# Altium schematic sheet 0084 - MCU.SchDoc: 0084 - AR Display Board
size Tabloid; Date: 3/18/2018; DrawnBy: Ryan Young; DocumentNumber: 1; Revision: 2.1; SheetNumber: 2; SheetTotal: 3; SheetTitle: MCU; PageSetup: Record=PageOptions|CenterHorizontal=True|CenterVertical=True|PrintScale=0.95|XCorrection=1.00|YCorrection=1.00|PrintKind=0|BorderSize=5000000|LeftOffset=0|BottomOffset=0|Orientation=2|PaperLength=1000|PaperWidth=1000|Scale=100|PaperSource=15|PrintQuality=600|MediaType=1|DitherType=10|PaperKind=Letter (8.5 x 11")|PrintScaleMode=1; Time: 3/18/2018
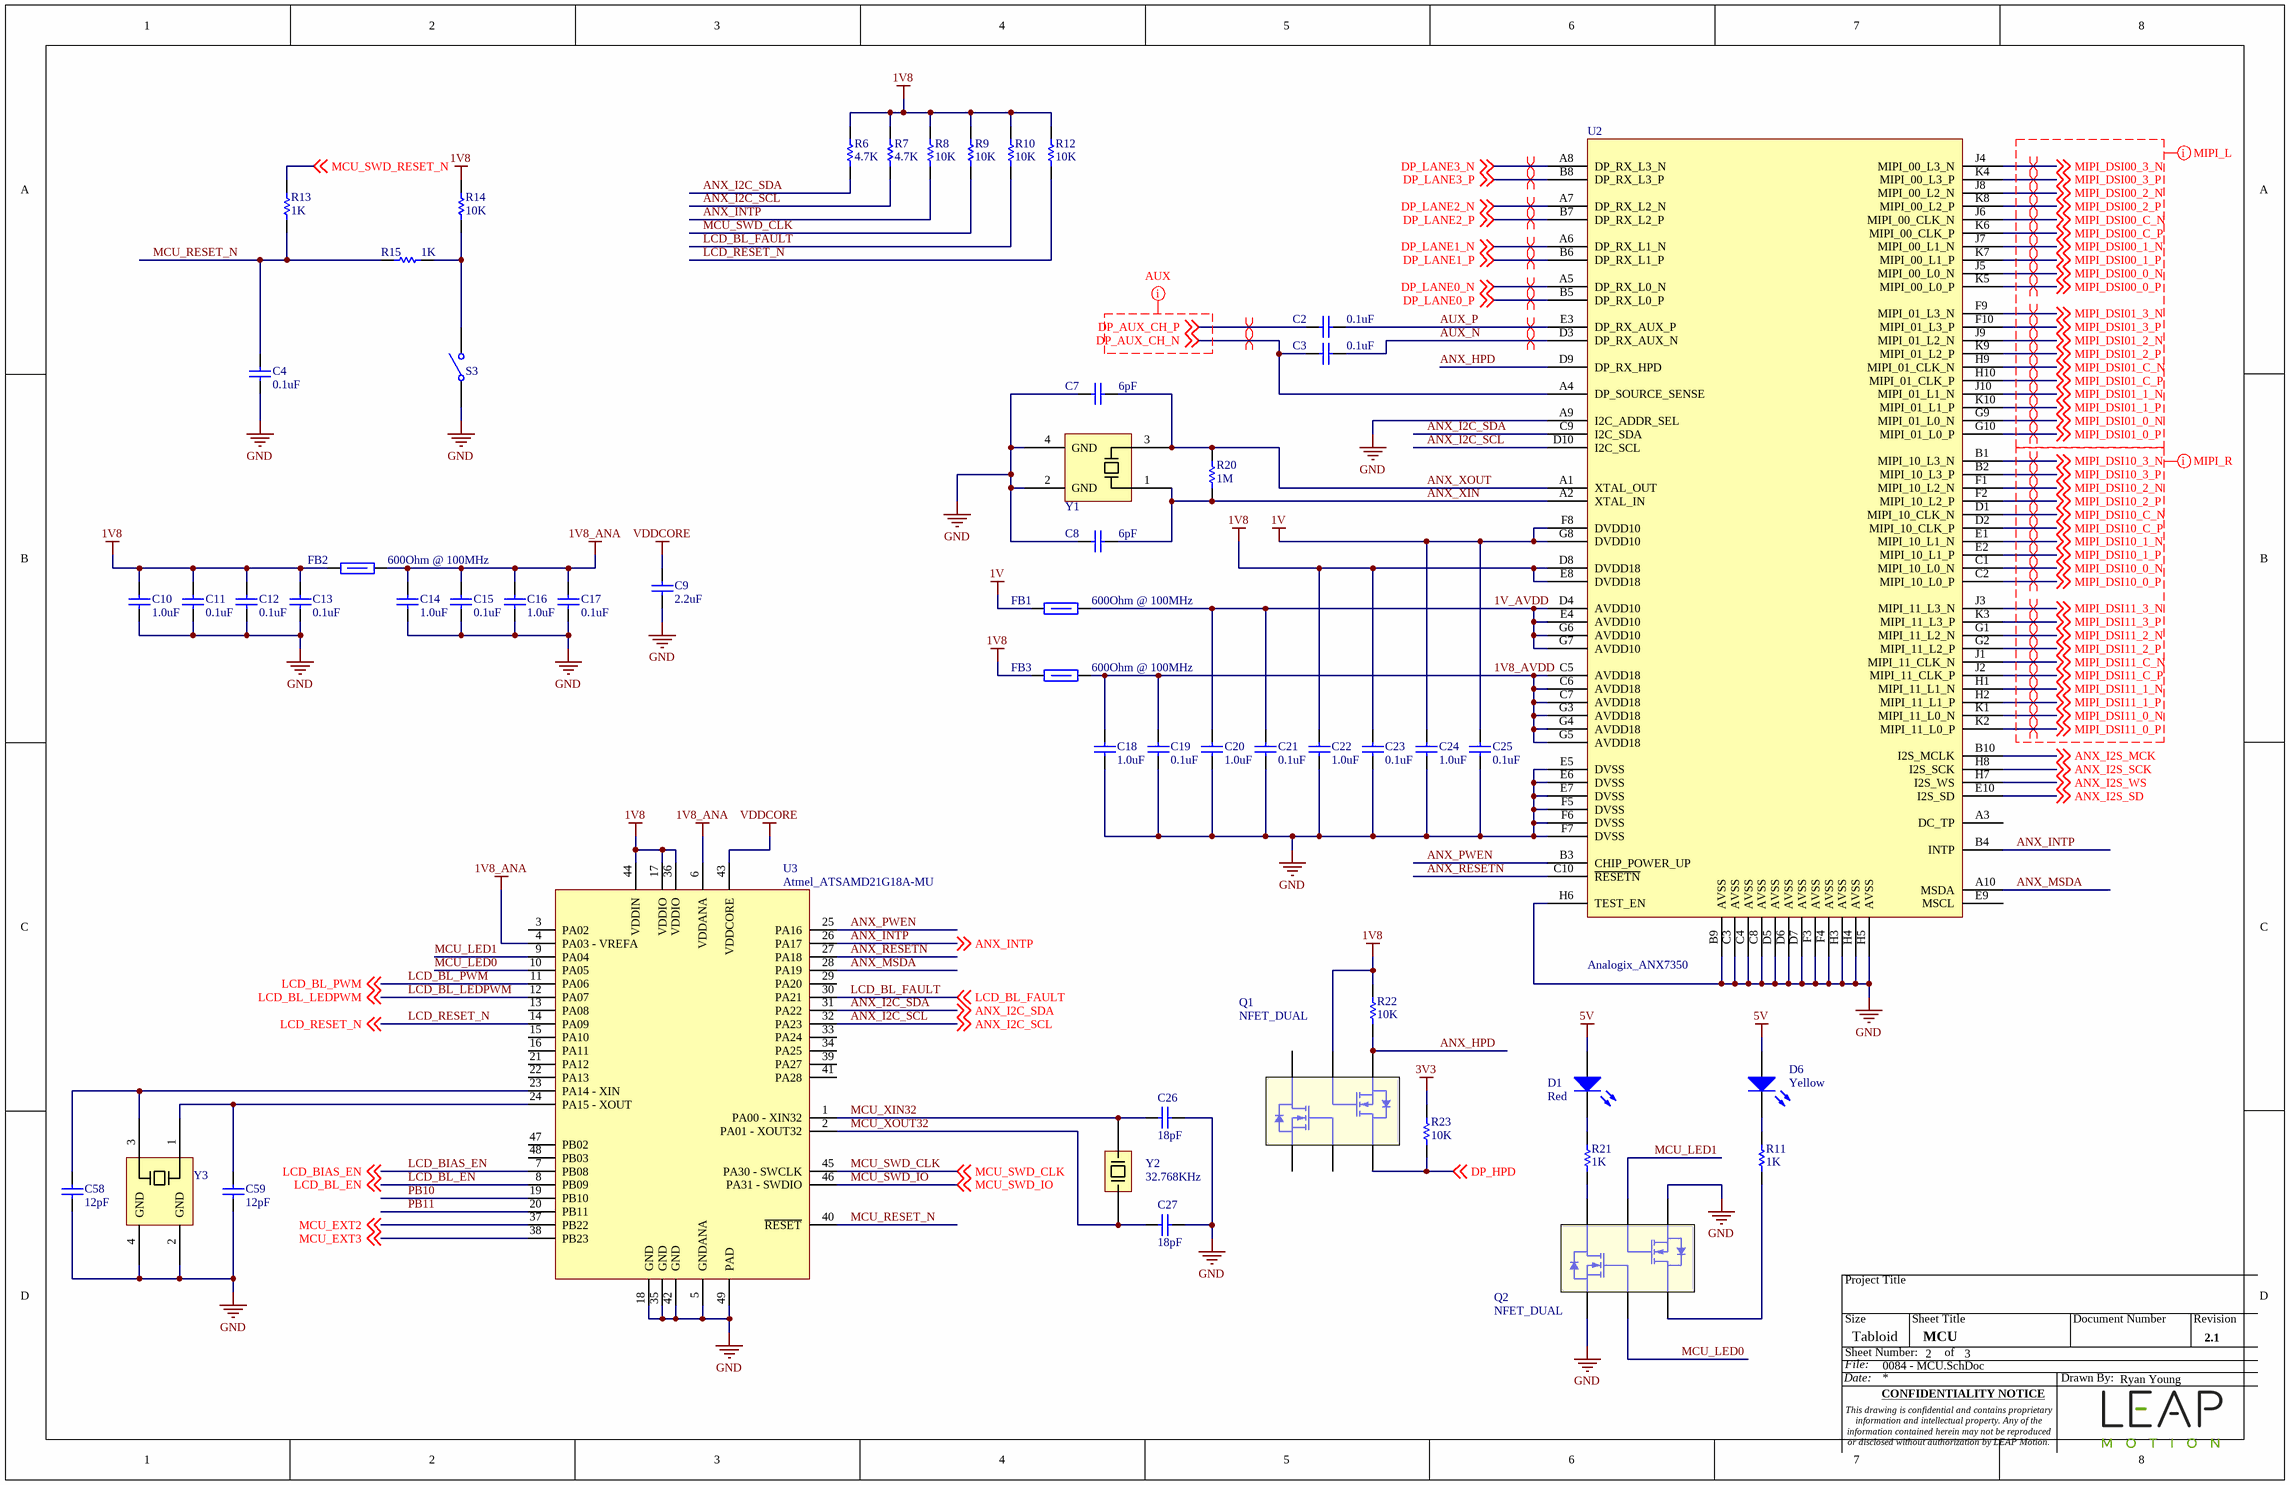
[diagram p0: 0084 - MCU.SchDoc]

## Parts
C2  0.1uF  [CAPC0201(0603)33_N]
C3  0.1uF  [CAPC0201(0603)33_N]
C4  0.1uF  [CAPC0201(0603)33_N]
C7  6pF  [CAPC0201(0603)33_N]
C8  6pF  [CAPC0201(0603)33_N]
C9  2.2uF  [CAPC0402(1005)60_N]
C10  1.0uF  [CAPC0402(1005)60_N]
C11  0.1uF  [CAPC0201(0603)33_N]
C12  0.1uF  [CAPC0201(0603)33_N]
C13  0.1uF  [CAPC0201(0603)33_N]
C14  1.0uF  [CAPC0402(1005)60_N]
C15  0.1uF  [CAPC0201(0603)33_N]
C16  1.0uF  [CAPC0402(1005)60_N]
C17  0.1uF  [CAPC0201(0603)33_N]
C18  1.0uF  [CAPC0402(1005)60_L]  (no BOM)
C19  0.1uF  [CAPC0201(0603)33_L]  (no BOM)
C20  1.0uF  [CAPC0402(1005)60_L]  (no BOM)
C21  0.1uF  [CAPC0201(0603)33_L]  (no BOM)
C22  1.0uF  [CAPC0402(1005)60_L]  (no BOM)
C23  0.1uF  [CAPC0201(0603)33_L]  (no BOM)
C24  1.0uF  [CAPC0402(1005)60_L]  (no BOM)
C25  0.1uF  [CAPC0201(0603)33_L]  (no BOM)
C26  18pF  [CAPC0201(0603)33_N]
C27  18pF  [CAPC0201(0603)33_N]
C58  12pF  [CAPC0201(0603)33_N]
C59  12pF  [CAPC0201(0603)33_N]
D1  Color: Red  [Dialight_598-8010-107F]
D6  Color: Yellow  [Dialight_598-8040-107F]
FB1  Impedance @ Freq: 600Ohm @ 100MHz  [INDC1608X09N]  (hidden comment: Ferrite Bead)
FB2  Impedance @ Freq: 600Ohm @ 100MHz  [INDC1608X09N]  (hidden comment: Ferrite Bead)
FB3  Impedance @ Freq: 600Ohm @ 100MHz  [INDC1608X09N]  (hidden comment: Ferrite Bead)
Q1  NFET_DUAL  [SOT-563]
Q2  NFET_DUAL  [SOT-563]
R6  4.7K  [RESC0201(0603)_N]
R7  4.7K  [RESC0201(0603)_N]
R8  10K  [RESC0201(0603)_N]
R9  10K  [RESC0201(0603)_N]
R10  10K  [RESC0201(0603)_N]
R11  1K  [RESC0201(0603)_N]
R12  10K  [RESC0201(0603)_N]
R13  1K  [RESC0201(0603)_N]
R14  10K  [RESC0201(0603)_N]
R15  1K  [RESC0201(0603)_N]
R20  1M  [RESC0201(0603)_N]
R21  1K  [RESC0201(0603)_N]
R22  10K  [RESC0201(0603)_N]
R23  10K  [RESC0201(0603)_N]
S3  SW-SPST  [ALPS_SKRPABE010]  (value not drawn)
U2  Analogix_ANX7350  [Analogix_ANX7350]
U3  Atmel_ATSAMD21G18A-MU  [Atmel_ATSAMD21G18A-MU]
Y1  Crystal  [Abracon_ABM11]  (value not drawn)
Y2  Frequency: 32.768KHz  [Abracon_ABS07]  (hidden comment: Crystal_2pin)
Y3  Crystal  [Abracon_ABM11]  (value not drawn)

## Nets
1V: C24.2 C25.2 FB1.1 U2.F8(DVDD10) U2.G8(DVDD10)
1V8: C10.2 C11.2 C12.2 C13.2 C22.2 C23.2 FB2.1 FB3.1 Q1.5(G2) R6.2 R7.2 R8.2 R9.2 R10.2 R12.2 R14.2 R22.2 U2.D8(DVDD18) U2.E8(DVDD18) U3.17(VDDIO) U3.36(VDDIO) U3.44(VDDIN)
1V8_ANA: C14.2 C15.2 C16.2 C17.2 FB2.2 U3.4(PA03_-_VREFA) U3.6(VDDANA)
3V3: R23.1
5V: D1.A D6.A
GND: C4.1 C7.2 C8.2 C9.2 C10.1 C11.1 C12.1 C13.1 C14.1 C15.1 C16.1 C17.1 C18.1 C19.1 C20.1 C21.1 C22.1 C23.1 C24.1 C25.1 C26.2 C27.2 C58.2 C59.2 Q2.1(S1) Q2.4(S2) S3.1(COMMON) U2.A9(I2C_ADDR_SEL) U2.B9(AVSS) U2.C3(AVSS) U2.C4(AVSS) U2.C8(AVSS) U2.D5(AVSS) U2.D6(AVSS) U2.D7(AVSS) U2.E5(DVSS) U2.E6(DVSS) U2.E7(DVSS) U2.F3(AVSS) U2.F4(AVSS) U2.F5(DVSS) U2.F6(DVSS) U2.F7(DVSS) U2.H3(AVSS) U2.H4(AVSS) U2.H5(AVSS) U2.H6(TEST_EN) U3.5(GNDANA) U3.18(GND) U3.35(GND) U3.42(GND) U3.49(PAD) Y1.2(GND) Y1.4(GND) Y3.2(GND) Y3.4(GND)
VDDCORE: C9.1 U3.43(VDDCORE)
1V8_AVDD: C18.2 C19.2 FB3.2 U2.C5(AVDD18) U2.C6(AVDD18) U2.C7(AVDD18) U2.G3(AVDD18) U2.G4(AVDD18) U2.G5(AVDD18)
1V_AVDD: C20.2 C21.2 FB1.2 U2.D4(AVDD10) U2.E4(AVDD10) U2.G6(AVDD10) U2.G7(AVDD10)
ANX_HPD: Q1.4(S2) R22.1 U2.D9(DP_RX_HPD)
ANX_I2C_SCL: R7.1 U2.D10(I2C_SCL) U3.32(PA23) ; off-sheet ANX_I2C_SCL
ANX_I2C_SDA: R6.1 U2.C9(I2C_SDA) U3.31(PA22) ; off-sheet ANX_I2C_SDA
ANX_I2S_MCK: U2.B10(I2S_MCLK) ; off-sheet ANX_I2S_MCK
ANX_I2S_SCK: U2.H8(I2S_SCK) ; off-sheet ANX_I2S_SCK
ANX_I2S_SD: U2.E10(I2S_SD) ; off-sheet ANX_I2S_SD
ANX_I2S_WS: U2.H7(I2S_WS) ; off-sheet ANX_I2S_WS
ANX_INTP: R8.1 U2.B4(INTP) U3.26(PA17) ; off-sheet ANX_INTP
ANX_MSDA: U2.A10(MSDA) U3.28(PA19)
ANX_PWEN: U2.B3(CHIP_POWER_UP) U3.25(PA16)
ANX_RESETN: U2.C10(~{RESETN}) U3.27(PA18)
ANX_XIN: C8.1 R20.1 U2.A2(XTAL_IN) Y1.1(XTAL1)
ANX_XOUT: C7.1 R20.2 U2.A1(XTAL_OUT) Y1.3(XTAL2)
AUX_N: C3.1 U2.D3(DP_RX_AUX_N)
AUX_P: C2.1 U2.E3(DP_RX_AUX_P)
DP_AUX_CH_N: C3.2 U2.A4(DP_SOURCE_SENSE) ; off-sheet DP_AUX_CH_N
DP_AUX_CH_P: C2.2 ; off-sheet DP_AUX_CH_P
DP_HPD: Q1.3(D2) R23.2 ; off-sheet DP_HPD
DP_LANE0_N: U2.A5(DP_RX_L0_N) ; off-sheet DP_LANE0_N
DP_LANE0_P: U2.B5(DP_RX_L0_P) ; off-sheet DP_LANE0_P
DP_LANE1_N: U2.A6(DP_RX_L1_N) ; off-sheet DP_LANE1_N
DP_LANE1_P: U2.B6(DP_RX_L1_P) ; off-sheet DP_LANE1_P
DP_LANE2_N: U2.A7(DP_RX_L2_N) ; off-sheet DP_LANE2_N
DP_LANE2_P: U2.B7(DP_RX_L2_P) ; off-sheet DP_LANE2_P
DP_LANE3_N: U2.A8(DP_RX_L3_N) ; off-sheet DP_LANE3_N
DP_LANE3_P: U2.B8(DP_RX_L3_P) ; off-sheet DP_LANE3_P
LCD_BIAS_EN: U3.7(PB08) ; off-sheet LCD_BIAS_EN
LCD_BL_EN: U3.8(PB09) ; off-sheet LCD_BL_EN
LCD_BL_FAULT: R10.1 U3.30(PA21) ; off-sheet LCD_BL_FAULT
LCD_BL_LEDPWM: U3.12(PA07) ; off-sheet LCD_BL_LEDPWM
LCD_BL_PWM: U3.11(PA06) ; off-sheet LCD_BL_PWM
LCD_RESET_N: R12.1 U3.14(PA09) ; off-sheet LCD_RESET_N
MCU_EXT2: U3.37(PB22) ; off-sheet MCU_EXT2
MCU_EXT3: U3.38(PB23) ; off-sheet MCU_EXT3
MCU_LED0: Q2.2(G1) U3.10(PA05)
MCU_LED1: Q2.5(G2) U3.9(PA04)
MCU_RESET_N: C4.2 R13.2 R15.2 U3.40(~{RESET})
MCU_SWD_CLK: R9.1 U3.45(PA30_-_SWCLK) ; off-sheet MCU_SWD_CLK
MCU_SWD_IO: U3.46(PA31_-_SWDIO) ; off-sheet MCU_SWD_IO
MCU_SWD_RESET_N: R13.1 ; off-sheet MCU_SWD_RESET_N
MCU_XIN32: C26.1 U3.1(PA00_-_XIN32) Y2.1(XTAL2)
MCU_XOUT32: C27.1 U3.2(PA01_-_XOUT32) Y2.0(XTAL1)
MIPI_DSI00_0_N: U2.J5(MIPI_00_L0_N) ; off-sheet MIPI_DSI00_0_N
MIPI_DSI00_0_P: U2.K5(MIPI_00_L0_P) ; off-sheet MIPI_DSI00_0_P
MIPI_DSI00_1_N: U2.J7(MIPI_00_L1_N) ; off-sheet MIPI_DSI00_1_N
MIPI_DSI00_1_P: U2.K7(MIPI_00_L1_P) ; off-sheet MIPI_DSI00_1_P
MIPI_DSI00_2_N: U2.J8(MIPI_00_L2_N) ; off-sheet MIPI_DSI00_2_N
MIPI_DSI00_2_P: U2.K8(MIPI_00_L2_P) ; off-sheet MIPI_DSI00_2_P
MIPI_DSI00_3_N: U2.J4(MIPI_00_L3_N) ; off-sheet MIPI_DSI00_3_N
MIPI_DSI00_3_P: U2.K4(MIPI_00_L3_P) ; off-sheet MIPI_DSI00_3_P
MIPI_DSI00_C_N: U2.J6(MIPI_00_CLK_N) ; off-sheet MIPI_DSI00_C_N
MIPI_DSI00_C_P: U2.K6(MIPI_00_CLK_P) ; off-sheet MIPI_DSI00_C_P
MIPI_DSI01_0_N: U2.G9(MIPI_01_L0_N) ; off-sheet MIPI_DSI01_0_N
MIPI_DSI01_0_P: U2.G10(MIPI_01_L0_P) ; off-sheet MIPI_DSI01_0_P
MIPI_DSI01_1_N: U2.J10(MIPI_01_L1_N) ; off-sheet MIPI_DSI01_1_N
MIPI_DSI01_1_P: U2.K10(MIPI_01_L1_P) ; off-sheet MIPI_DSI01_1_P
MIPI_DSI01_2_N: U2.J9(MIPI_01_L2_N) ; off-sheet MIPI_DSI01_2_N
MIPI_DSI01_2_P: U2.K9(MIPI_01_L2_P) ; off-sheet MIPI_DSI01_2_P
MIPI_DSI01_3_N: U2.F9(MIPI_01_L3_N) ; off-sheet MIPI_DSI01_3_N
MIPI_DSI01_3_P: U2.F10(MIPI_01_L3_P) ; off-sheet MIPI_DSI01_3_P
MIPI_DSI01_C_N: U2.H9(MIPI_01_CLK_N) ; off-sheet MIPI_DSI01_C_N
MIPI_DSI01_C_P: U2.H10(MIPI_01_CLK_P) ; off-sheet MIPI_DSI01_C_P
MIPI_DSI10_0_N: U2.C1(MIPI_10_L0_N) ; off-sheet MIPI_DSI10_0_N
MIPI_DSI10_0_P: U2.C2(MIPI_10_L0_P) ; off-sheet MIPI_DSI10_0_P
MIPI_DSI10_1_N: U2.E1(MIPI_10_L1_N) ; off-sheet MIPI_DSI10_1_N
MIPI_DSI10_1_P: U2.E2(MIPI_10_L1_P) ; off-sheet MIPI_DSI10_1_P
MIPI_DSI10_2_N: U2.F1(MIPI_10_L2_N) ; off-sheet MIPI_DSI10_2_N
MIPI_DSI10_2_P: U2.F2(MIPI_10_L2_P) ; off-sheet MIPI_DSI10_2_P
MIPI_DSI10_3_N: U2.B1(MIPI_10_L3_N) ; off-sheet MIPI_DSI10_3_N
MIPI_DSI10_3_P: U2.B2(MIPI_10_L3_P) ; off-sheet MIPI_DSI10_3_P
MIPI_DSI10_C_N: U2.D1(MIPI_10_CLK_N) ; off-sheet MIPI_DSI10_C_N
MIPI_DSI10_C_P: U2.D2(MIPI_10_CLK_P) ; off-sheet MIPI_DSI10_C_P
MIPI_DSI11_0_N: U2.K1(MIPI_11_L0_N) ; off-sheet MIPI_DSI11_0_N
MIPI_DSI11_0_P: U2.K2(MIPI_11_L0_P) ; off-sheet MIPI_DSI11_0_P
MIPI_DSI11_1_N: U2.H1(MIPI_11_L1_N) ; off-sheet MIPI_DSI11_1_N
MIPI_DSI11_1_P: U2.H2(MIPI_11_L1_P) ; off-sheet MIPI_DSI11_1_P
MIPI_DSI11_2_N: U2.G1(MIPI_11_L2_N) ; off-sheet MIPI_DSI11_2_N
MIPI_DSI11_2_P: U2.G2(MIPI_11_L2_P) ; off-sheet MIPI_DSI11_2_P
MIPI_DSI11_3_N: U2.J3(MIPI_11_L3_N) ; off-sheet MIPI_DSI11_3_N
MIPI_DSI11_3_P: U2.K3(MIPI_11_L3_P) ; off-sheet MIPI_DSI11_3_P
MIPI_DSI11_C_N: U2.J1(MIPI_11_CLK_N) ; off-sheet MIPI_DSI11_C_N
MIPI_DSI11_C_P: U2.J2(MIPI_11_CLK_P) ; off-sheet MIPI_DSI11_C_P
PB10: U3.19(PB10)
PB11: U3.20(PB11)
NetC58_1: C58.1 U3.23(PA14_-_XIN) Y3.3(XTAL2)
NetC59_1: C59.1 U3.24(PA15_-_XOUT) Y3.1(XTAL1)
NetD1_K: D1.K R21.1
NetD6_K: D6.K R11.1
NetQ2_3: Q2.3(D2) R11.2
NetQ2_6: Q2.6(D1) R21.2
NetR14_1: R14.1 R15.1 S3.2(NO)

Not connected (* = marked no-connect by the designer): Q1 1(S1) 2(G1) 6(D1); U2 A3(DC_TP) E9(MSCL); U3 3(PA02) 13(PA08) 15(PA10) 16(PA11) 21(PA12) 22(PA13) 29(PA20) 33(PA24) 34(PA25) 39(PA27) 41(PA28) 47(PB02) 48(PB03)

## Layout directives
differential pair: AUX_N, AUX_P, DP_AUX_CH_N, DP_AUX_CH_P, DP_LANE0_N, DP_LANE0_P, DP_LANE1_N, DP_LANE1_P, DP_LANE2_N, DP_LANE2_P, DP_LANE3_N, DP_LANE3_P, MIPI_DSI00_0_N, MIPI_DSI00_0_P, MIPI_DSI00_1_N, MIPI_DSI00_1_P, MIPI_DSI00_2_N, MIPI_DSI00_2_P, MIPI_DSI00_3_N, MIPI_DSI00_3_P, MIPI_DSI00_C_N, MIPI_DSI00_C_P, MIPI_DSI01_0_N, MIPI_DSI01_0_P, MIPI_DSI01_1_N, MIPI_DSI01_1_P, MIPI_DSI01_2_N, MIPI_DSI01_2_P, MIPI_DSI01_3_N, MIPI_DSI01_3_P, MIPI_DSI01_C_N, MIPI_DSI01_C_P, MIPI_DSI10_0_N, MIPI_DSI10_0_P, MIPI_DSI10_1_N, MIPI_DSI10_1_P, MIPI_DSI10_2_N, MIPI_DSI10_2_P, MIPI_DSI10_3_N, MIPI_DSI10_3_P, MIPI_DSI10_C_N, MIPI_DSI10_C_P, MIPI_DSI11_0_N, MIPI_DSI11_0_P, MIPI_DSI11_1_N, MIPI_DSI11_1_P, MIPI_DSI11_2_N, MIPI_DSI11_2_P, MIPI_DSI11_3_N, MIPI_DSI11_3_P, MIPI_DSI11_C_N, MIPI_DSI11_C_P
net class MIPI_L: MIPI_DSI00_0_N, MIPI_DSI00_0_P, MIPI_DSI00_1_N, MIPI_DSI00_1_P, MIPI_DSI00_2_N, MIPI_DSI00_2_P, MIPI_DSI00_3_N, MIPI_DSI00_3_P, MIPI_DSI00_C_N, MIPI_DSI00_C_P, MIPI_DSI01_0_N, MIPI_DSI01_0_P, MIPI_DSI01_1_N, MIPI_DSI01_1_P, MIPI_DSI01_2_N, MIPI_DSI01_2_P, MIPI_DSI01_3_N, MIPI_DSI01_3_P, MIPI_DSI01_C_N, MIPI_DSI01_C_P
net class MIPI_R: MIPI_DSI10_0_N, MIPI_DSI10_0_P, MIPI_DSI10_1_N, MIPI_DSI10_1_P, MIPI_DSI10_2_N, MIPI_DSI10_2_P, MIPI_DSI10_3_N, MIPI_DSI10_3_P, MIPI_DSI10_C_N, MIPI_DSI10_C_P, MIPI_DSI11_0_N, MIPI_DSI11_0_P, MIPI_DSI11_1_N, MIPI_DSI11_1_P, MIPI_DSI11_2_N, MIPI_DSI11_2_P, MIPI_DSI11_3_N, MIPI_DSI11_3_P, MIPI_DSI11_C_N, MIPI_DSI11_C_P
net class AUX: DP_AUX_CH_N, DP_AUX_CH_P

## Notes on the sheet
- Project Title
- Size
- Sheet Number:
- File:
- Tabloid
- Sheet Title
- of
- Document Number
- Revision
- Date:
- CONFIDENTIALITY NOTICE
- Drawn By:
- This drawing is confidential and contains proprietary information and intellectual property. Any of the information contained herein may not be reproduced or disclosed without authorization by LEAP Motion.

## Library data of the parts
C2-C4 C11-C13 C15 C17 C19 C21 C23 C25 = CAP_0060: Capacitor, 0.1uF, 10V, 10%, 0201, Ceramic, X5R; Manufacturer: Murata; Manufacturer P/N: GRM033R61A104KE15D; Polarity: No; Temp Range: -55C - 85C; P/N: CAP_0060; Display: 0.1uF, 10V; Value: 0.1uF; Tolerance: 10%; Voltage Rating: 10V; Dielectric: X5R; Material: Ceramic; Package: 0201; Max Height: 0.15mm; RoHS: True; Supplier: Mouser; Supplier P/N: 581-81-GRM033R61A104KE5D; Supplier Price: 0.1; Datasheet: http://www.mouser.com/ds/2/281/c02e-2905.pdf; Date: 6/29/2016; Author: AA
C7 C8 = CAP_0064: Capacitor, 6pF, 50V, 0.1pF, 0201, Ceramic, C0G(NP0); Manufacturer: Murata; Manufacturer P/N: GRM0335C1H6R0BA01D; Polarity: No; Temp Range: -55C - 125C; P/N: CAP_0064; Display: 6pF, 50V; Value: 6pF; Tolerance: 0.1pF; Voltage Rating: 50V; Dielectric: C0G(NP0); Material: Ceramic; Package: 0201; Max Height: 0.15mm; RoHS: True; Supplier: Digikey; Supplier P/N: 490-11339-1-ND; Supplier Price: 0.1; Datasheet: http://search.murata.co.jp/Ceramy/image/img/A01X/G101/ENG/GRM0335C1H6R0BA01-01.pdf; Date: 7/19/2017; Author: RY
C9 = CAP_0016: Capacitor, 2.2uF, 6.3V, 20%, 0402, Ceramic, X5R; Manufacturer: TDK; Manufacturer P/N: C1005X5R0J225M050BC; Polarity: No; Temp Range: -55C - 85C; P/N: CAP_0016; Display: 2.2uF, 6.3V; Value: 2.2uF; Tolerance: 20%; Voltage Rating: 6.3V; Dielectric: X5R; Material: Ceramic; Package: 0402; Max Height: 0.55mm; RoHS: True; Supplier: Digikey; Supplier P/N: 445-4999-1-ND; Supplier Price: 0.27; Datasheet: http://www.tdk.com/pdf/TDKMLCCCapRange.pdf; Date: 4/30/2013; Author: NR
C10 C14 C16 C18 C20 C22 C24 = CAP_0023: Capacitor, 1.0uF, 10V, 10%, 0402, Ceramic, X5R; Manufacturer: TDK; Manufacturer P/N: C1005X5R1A105K050BB; Polarity: No; Temp Range: -55C - 85C; P/N: CAP_0023; Display: 1.0uF, 10V; Value: 1.0uF; Tolerance: 10%; Voltage Rating: 10V; Dielectric: X5R; Material: Ceramic; Package: 0402; Max Height: 0.55mm; RoHS: True; Supplier: Digikey; Supplier P/N: 445-4114-6-ND; Supplier Price: 0.1; Datasheet: http://product.tdk.com/capacitor/mlcc/en/documents/mlcc_commercial_general_en.pdf; Date: 8/28/2013; Author: NR
C26 C27 = CAP_0066: Capacitor, 18pF, 50V, 2%, 0201, Ceramic, C0G(NP0); Manufacturer: Murata; Manufacturer P/N: GRM0335C1H180GA01D; Polarity: No; Temp Range: -55C - 125C; P/N: CAP_0066; Display: 18pF, 50V; Value: 18pF; Tolerance: 2%; Voltage Rating: 50V; Dielectric: C0G(NP0); Material: Ceramic; Package: 0201; Max Height: 0.15mm; RoHS: True; Supplier: Digikey; Supplier P/N: 490-11310-1-ND; Supplier Price: 0.1; Datasheet: http://search.murata.co.jp/Ceramy/image/img/A01X/G101/ENG/GRM0335C1H6R0BA01-01.pdf; Date: 7/19/2017; Author: RY
C58 C59 = CAP_0065: Capacitor, 12pF, 50V, 2%, 0201, Ceramic, C0G(NP0); Manufacturer: Murata; Manufacturer P/N: GRM0335C1H120GA01D; Polarity: No; Temp Range: -55C - 125C; P/N: CAP_0065; Display: 12pF, 50V; Value: 12pF; Tolerance: 2%; Voltage Rating: 50V; Dielectric: C0G(NP0); Material: Ceramic; Package: 0201; Max Height: 0.15mm; RoHS: True; Supplier: Digikey; Supplier P/N: 490-11308-1-ND; Supplier Price: 0.1; Datasheet: http://search.murata.co.jp/Ceramy/image/img/A01X/G101/ENG/GRM0335C1H6R0BA01-01.pdf; Date: 7/19/2017; Author: RY
D1 = LED_0017: LED, 635nm, 140deg, , 20mA, , 1.6mm x 0.8mm, -30C - 85C; Manufacturer: Dialight; Manufacturer P/N: 598-8010-107F; Vf: 1.7V; Radiant Intensity (mW/sr): 40mcd; P/N: LED_0017; Display: LED, 635nm, 140deg; Class: LED; Center Wavelength: 635nm; If_Surge: 20mA; If: 20mA; Half Angle: 140deg; Package: 1.6mm x 0.8mm; Max Height: 0.7mm; Temp Range: -30C - 85C; RoHS: True; Supplier: Mouser; Supplier P/N: 645-598-8010-107F; Supplier Price: 0.45; Datasheet: http://www.mouser.com/catalog/specsheets/SMT_selector_guide.pdf; Date: 1/20/2014; Author: JDS
D6 = LED_0034: LED, 593nm, 140deg, , 20mA, , 1.6mm x 0.8mm, -30C - 85C; Manufacturer: Dialight; Manufacturer P/N: 598-8040-107F; Vf: 2V; Radiant Intensity (mW/sr): 130mcd; P/N: LED_0034; Display: LED, 593nm, 140deg; Class: LED; Center Wavelength: 593nm; If_Surge: 20mA; If: 20mA; Half Angle: 140deg; Package: 1.6mm x 0.8mm; Max Height: 0.7mm; Temp Range: -30C - 85C; RoHS: True; Supplier: Mouser; Supplier P/N: 645-598-8040-107F; Supplier Price: 0.45; Datasheet: http://www.mouser.com/catalog/specsheets/SMT_selector_guide.pdf; Date: 11/11/2015; Author: JDS
FB1-FB3 = FB_0001: FERRITE CHIP BEAD 600 OHM SMD; Manufacturer: TDK; Manufacturer P/N: MPZ1608S601A; Current Rating: 1A; DCR: 150mOhm; P/N: FB_0001; Package: 0603; Operating Temp Range: -55C - 125C; Supplier: Digikey; Supplier P/N: 445-2205-1-ND; Supplier Price: 0.09; Datasheet: http://www.tdk.co.jp/tefe02/e9413_mpz.pdf; Date: 2/27/2013; Author: NR
Q1 Q2 = NFET_0009: Transistor, NFET_DUAL, 2.2Ohm, 200mA, 120mW, 	SOT-563, -55C - 150C; Manufacturer: Rohm Semiconductor; Manufacturer P/N: EM6K34T2CR; Display: NFET_DUAL, 	SOT-563; P/N: NFET_0009; Rds: 2.2Ohm; Drain Current: 200mA; Power Rating: 120mW; Package: SOT-563; Max Height: 0.5mm; Temp Range: -55C - 150C; RoHS: True; Supplier: Digikey; Supplier P/N: EM6K34T2CRCT-ND; Supplier Price: 0.45; Datasheet: http://rohmfs.rohm.com/en/products/databook/datasheet/discrete/transistor/mosfet/em6k34.pdf; Date: 7/19/2017; Author: RY
R6 R7 = RES_0040: Resistor, 4.7K, 1/20W, 1%, 0201; Manufacturer: Panasonic Electronic Components; Manufacturer P/N: ERJ-1GEF4701C; Display Value: 4.7K, 0201; Temp Range: -55C - 125C; P/N: RES_0040; Value: 4.7K; Tolerance: 1%; Power Rating: 1/20W; Package: 0201; Max Height: 0.26mm; RoHS: True; Supplier: Digikey; Supplier P/N: P4.70KABDKR-ND; Supplier Price: 0.11; Date: 8/9/2013; Author: NR
R8-R10 R12 R14 R22 R23 = RES_0014: Resistor, 10K, 1/20W, 5%, 0201; Manufacturer: Panasonic Electronic Components; Manufacturer P/N: ERJ-1GEJ103C; Display Value: 10K, 0201; Temp Range: -55C - 155C; P/N: RES_0014; Value: 10K; Tolerance: 5%; Power Rating: 1/20W; Package: 0201; Max Height: 0.26mm; RoHS: True; Supplier: Digikey; Supplier P/N: P10KAGCT-ND; Supplier Price: 0.1; Datasheet: http://industrial.panasonic.com/www-data/pdf/AOA0000/AOA0000CE2.pdf#http://industrial.panasonic.com/www-data/pdf/AOA0000/AOA0000CE2.pdf; Date: 2/25/2013; Author: NR
R11 R13 R15 R21 = RES_0036: Resistor, 1K, 1/20W, 5%, 0201; Manufacturer: Panasonic Electronic Components; Manufacturer P/N: ERJ-1GEJ102C; Display Value: 1K, 0201; Temp Range: -55C - 125C; P/N: RES_0036; Value: 1K; Tolerance: 5%; Power Rating: 1/20W; Package: 0201; Max Height: 0.26mm; RoHS: True; Supplier: Digikey; Supplier P/N: P1.0KAGCT-ND; Supplier Price: 0.1; Date: 7/25/2013; Author: JDS
R20 = RES_0178: Resistor, 1M, 1/20W, 1%, 0201; Manufacturer: Panasonic Electronic Components; Manufacturer P/N: ERJ-1GEF1004C; Display Value: 1M, 0201; Temp Range: -55C - 125C; P/N: RES_0178; Value: 1M; Tolerance: 1%; Power Rating: 1/20W; Package: 0201; Max Height: 0.26mm; RoHS: True; Supplier: Digikey; Supplier P/N: P1.00MABCT-ND; Supplier Price: 0.1; Datasheet: https://media.digikey.com/pdf/Data%20Sheets/Panasonic%20Resistors%20Thermistors%20PDFs/ERJ_G,R,E_Rev08.pdf; Date: 7/20/2017; Author: RY
S3 = SWT_0006: Switch, SPST-NO, Button, 4.6mm x 3.2mm; Manufacturer: ALPS; Manufacturer P/N: SKRPABE010; Display: Switch, SW-SPST; P/N: SWT_0006; Class: Switch; RoHS: True; Circuit: SPST-NO; Switch Function: Button; Operating Temperature: -30C - 85C; Footprint: 4.6mm x 3.2mm; Supplier: Mouser; Supplier P/N: 688-SKRPAB; Supplier Price: 0.41; Datasheet: #http://www.alps.com/products/WebObjects/catalog.woa/E/HTML/Tact/SurfaceMount/SKRP/SKRPABE010.html#; Date: 3/11/2014; Author: JDS
U2 = IC_0196: DisplayPort 1.4-to-Dual MIPI Output Converter; P/N: IC_0196; Manufacturer: Analogix; Manufacturer P/N: ANX7350; Package: VFBGA-100; Operating Temp Range: 0C - 70C; Date: 7/13/2017; Author: RY
U3 = IC_0197: IC MCU 32BIT 256KB FLASH 48QFN; Manufacturer: Atmel; P/N: IC_0197; Manufacturer P/N: ATSAMD21G18A-MU; Package: VQFN-48; Operating Temp Range: -40C - 85C; Supplier: Digikey; Supplier P/N: ATSAMD21G18A-MU-ND; Supplier Price: 3.15; Datasheet: http://ww1.microchip.com/downloads/en/DeviceDoc/40001882A.pdf; Date: 7/13/2017; Author: RY
Y1 = XTAL_0025: Crystal, 24MHz, 6pF, 4-SMD (2x1.6); Manufacturer: Abracon; Manufacturer P/N: XRCGB24M000F2P0R0; Tolerance: 20ppm; P/N: XTAL_0025; Type: Crystal; Frequency: 24MHz; Load Capacitance: 6pF; Package: 4-SMD (2x1.6); Operating Temp Range: -40C - 85C; Supplier: Mouser; Supplier P/N: 81-XRCGB24M000F2P0R0; Supplier Price: 0.38; Datasheet: http://www.mouser.com/ds/2/281/p79e-522722.pdf; Date: 9/14/2016; Author: AA
Y2 = XTAL_0023: Crystal, 32.768KHz, 12.5pF, 2-SMD(3.2x1.5); Manufacturer: Abracon; Manufacturer P/N: ABS07-32.768KHZ-T; Tolerance: 20 ppm; P/N: XTAL_0023; Type: Crystal; Load Capacitance: 12.5pF; Package: 2-SMD(3.2x1.5); Operating Temp Range: -40C - 85C; Supplier: Mouser; Supplier P/N: 815-ABS07-32.768KHZ-T; Supplier Price: 0.63; Datasheet: http://www.mouser.com/ds/2/3/ABS07-11028.pdf; Date: 11/16/2015; Author: JDS
Y3 = XTAL_0024: Crystal, 16MHz, 10pF, 4-SMD (2x1.6); Manufacturer: Abracon; Manufacturer P/N: ABM11-16.000MHZ-D2X-T3; Tolerance: 20ppm; P/N: XTAL_0024; Type: Crystal; Frequency: 16MHz; Load Capacitance: 10pF; Package: 4-SMD (2x1.6); Operating Temp Range: -40C - 85C; Supplier: Digikey; Supplier P/N: 535-12629-1-ND; Supplier Price: 1.04; Datasheet: http://www.abracon.com/Resonators/ABM11.pdf; Date: 3/28/2016; Author: JDS